# Altium schematic sheet 3rd_eyes.SchDoc
size A3; SheetNumber: 1; SheetTotal: 1
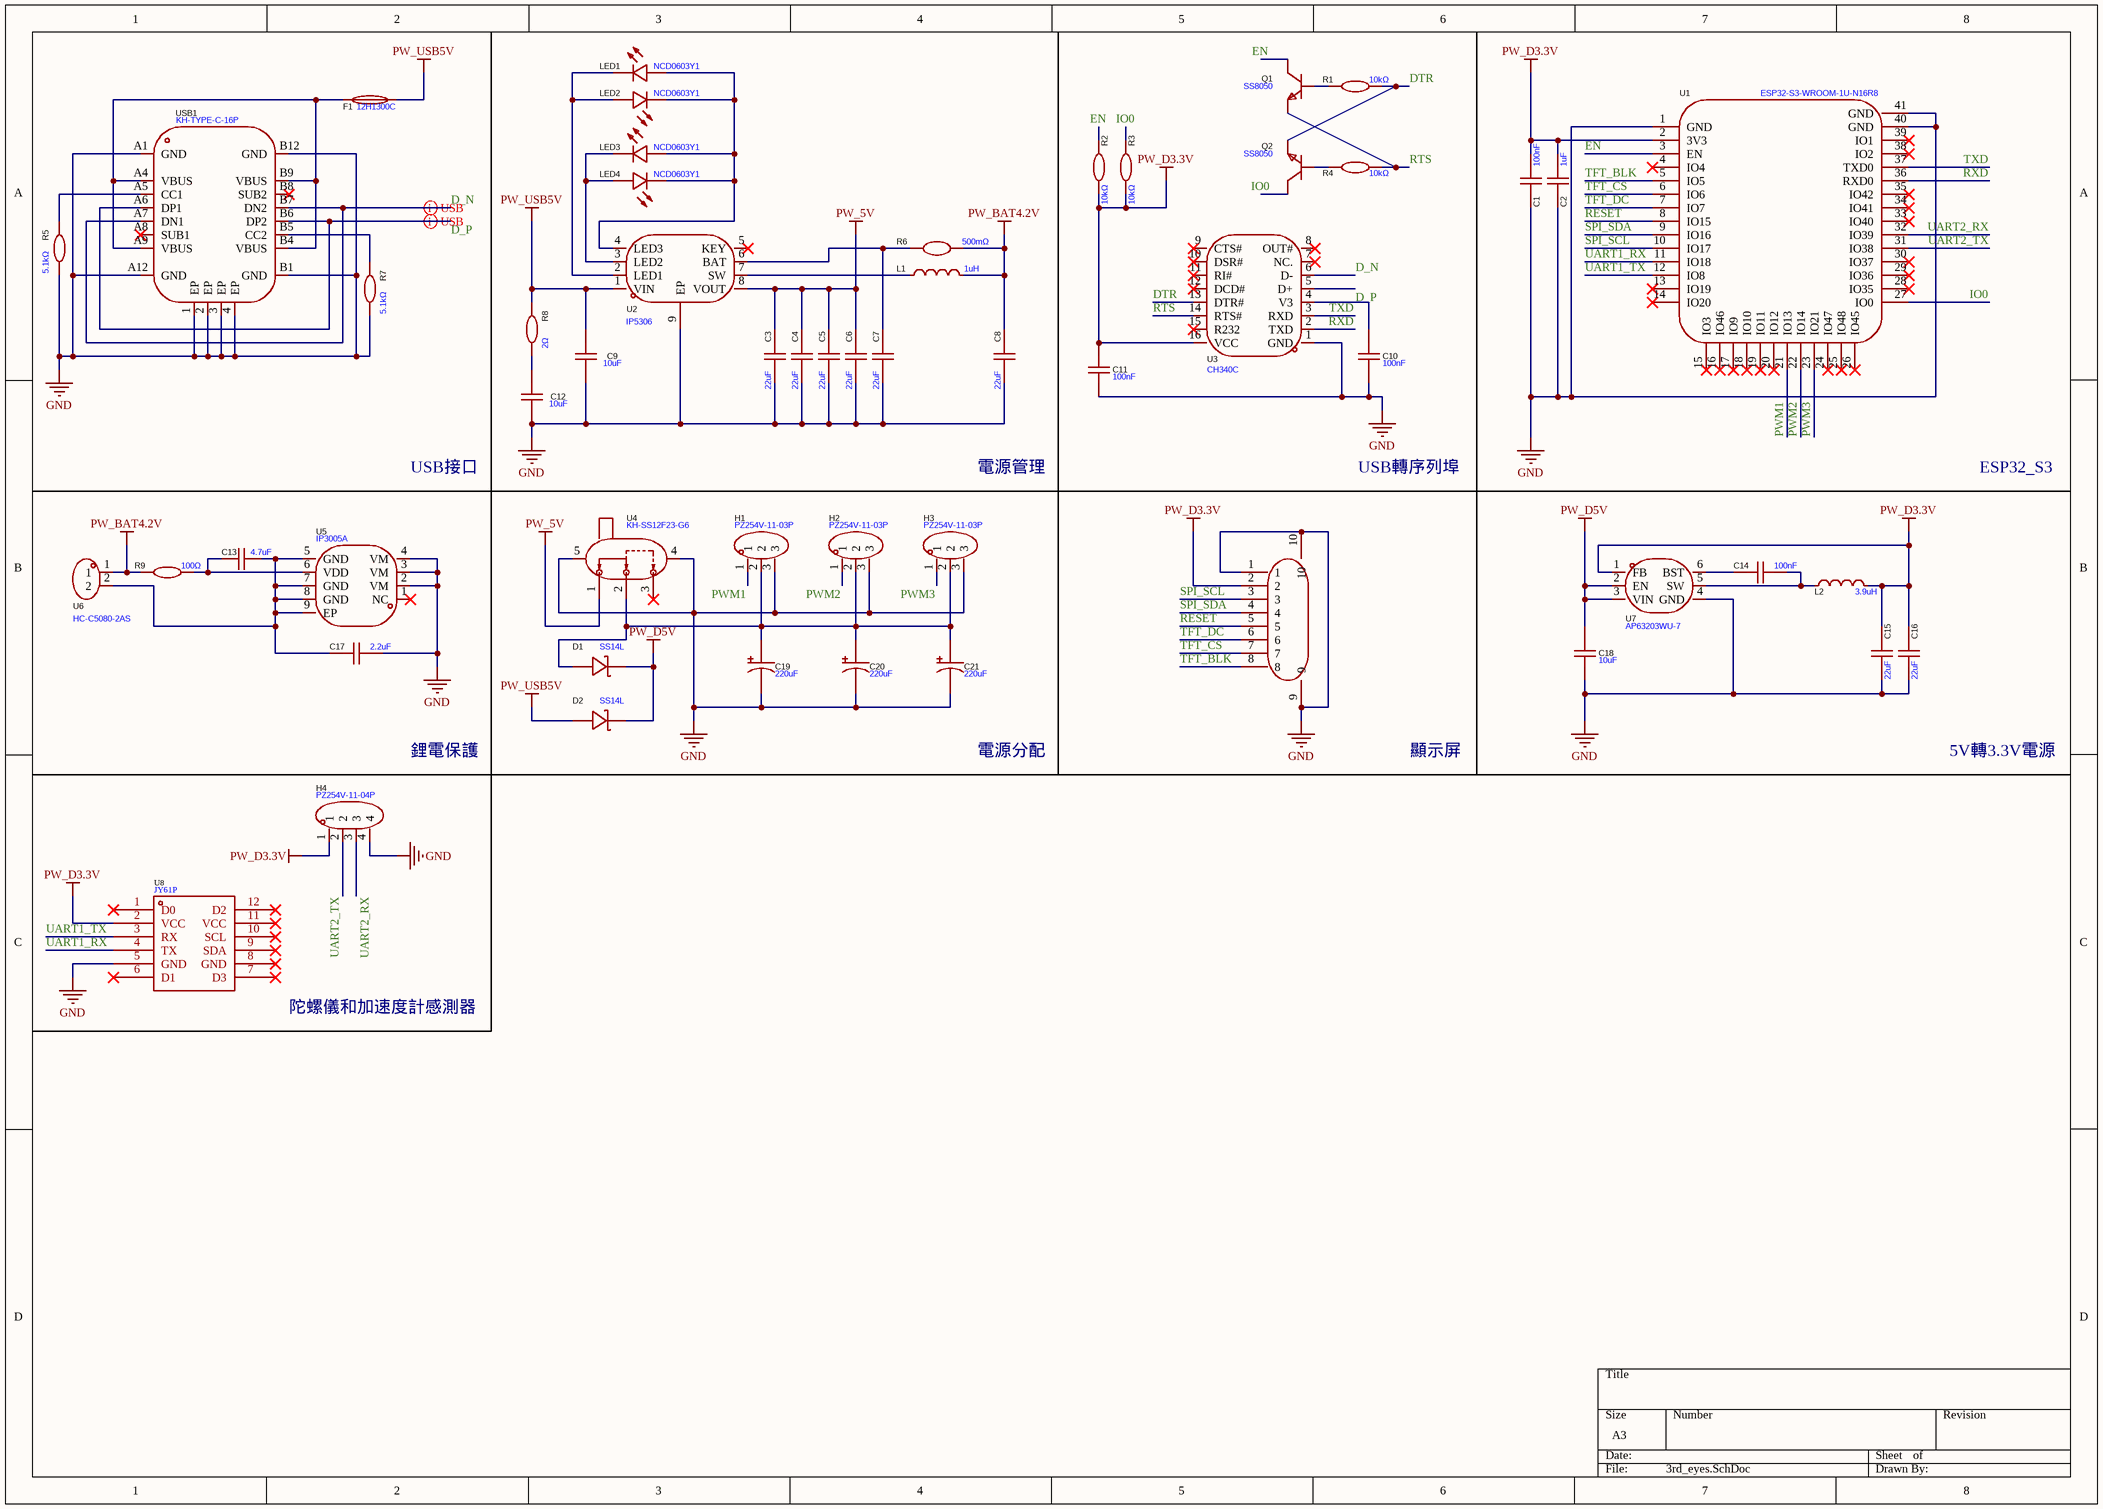
[diagram p0: 3rd_eyes.SchDoc]

## Parts
C1  100nF  [C0603]
C2  1uF  [C0603]
C3  22uF  [C0805]
C4  22uF  [C0805]
C5  22uF  [C0805]
C6  22uF  [C0805]
C7  22uF  [C0805]
C8  22uF  [C0805]
C9  10uF  [C0603]
C10  100nF  [C0603]
C11  100nF  [C0603]
C12  10uF  [C0603]
C13  4.7uF  [C0603]
C14  100nF  [C0603]
C15  22uF  [C0805]
C16  22uF  [C0805]
C17  2.2uF  [C0603]
C18  10uF  [C0603]
C19  220uF  [CAP-SMD_BD6.3-L6.6-W6.6-FD-A]
C20  220uF  [CAP-SMD_BD6.3-L6.6-W6.6-FD-A]
C21  220uF  [CAP-SMD_BD6.3-L6.6-W6.6-FD-A]
D1  SS14L  [SOD-123F_L2.8-W1.8-LS3.7-RD]
D2  SS14L  [SOD-123F_L2.8-W1.8-LS3.7-RD]
F1  12H1300C  [F1206]
FPC1  AFC01-S08FCA-00  [FPC-SMD_P0.50-8P_FGS-XJ-H2.0]  (value not drawn)
H1  PZ254V-11-03P  [HDR-TH_3P-P2.54-V-M]
H2  PZ254V-11-03P  [HDR-TH_3P-P2.54-V-M]
H3  PZ254V-11-03P  [HDR-TH_3P-P2.54-V-M]
H4  PZ254V-11-04P  [HDR-TH_4P-P2.54-V-M]
L1  1uH  [IND-SMD_L7.0-W6.6]
L2  3.9uH  [IND-SMD_L4.0-W4.0_FNR40XXS]
LED1  NCD0603Y1  [LED0603-RD]
LED2  NCD0603Y1  [LED0603-RD]
LED3  NCD0603Y1  [LED0603-RD]
LED4  NCD0603Y1  [LED0603-RD]
Q1  SS8050  [SOT-23-3_L2.9-W1.3-P1.90-LS2.4-BR]
Q2  SS8050  [SOT-23-3_L2.9-W1.3-P1.90-LS2.4-BR]
R1  10kΩ  [R0603]
R2  10kΩ  [R0603]
R3  10kΩ  [R0603]
R4  10kΩ  [R0603]
R5  5.1kΩ  [R0603]
R6  500mΩ  [R0805]
R7  5.1kΩ  [R0603]
R8  2Ω  [R0603]
R9  100Ω  [R0603]
U1  ESP32-S3-WROOM-1U-N16R8  [WIRELM-SMD_ESP32-S3-WROOM-1U]
U2  IP5306  [ESOP-8_L4.9-W3.9-P1.27-LS6.0-BL-EP]
U3  CH340C  [SOP-16_L10.0-W3.9-P1.27-LS6.0-BL]
U4  KH-SS12F23-G6  [SW-TH_KH-SS12F23-G6]
U5  IP3005A  [ESOP-8_L4.9-W3.9-P1.27-LS6.0-BL-EP]
U6  HC-C5080-2AS  [CONN-TH_HC-C5080-2AS]
U7  AP63203WU-7  [TSOT-26_L2.9-W1.6-P0.95-LS2.8-BL]
U8  JY61P  [JY61P]
USB1  KH-TYPE-C-16P  [USB-C-SMD_KH-TYPE-C-16P]

## Nets
GND: C1.1 C2.1 C3.1 C4.1 C5.1 C6.1 C7.1 C8.1 C9.1 C10.1 C11.1 C12.1 C15.2 C16.2 C17.2 C18.1 C19.2 C20.2 C21.2 FPC1.1 FPC1.9 FPC1.10 H1.3 H2.3 H3.3 H4.4 R5.2 R7.2 U1.1(GND) U1.40(GND) U1.41(GND) U2.9(EP) U3.1(GND) U4.4 U4.5 U5.2(VM) U5.3(VM) U5.4(VM) U7.4(GND) U8.5(GND) USB1.1(EP) USB1.2(EP) USB1.3(EP) USB1.4(EP) USB1.A1(GND) USB1.A12(GND) USB1.B1(GND) USB1.B12(GND)
PW_5V: C3.2 C4.2 C5.2 C6.2 U2.8(VOUT) U4.1
PW_BAT4.2V: C8.2 L1.2 R6.2 R9.1 U6.1
PW_D3.3V: C1.2 C2.2 C11.2 C15.1 C16.1 FPC1.2 H4.1 L2.2 R2.2 R3.2 U1.2(3V3) U3.16(VCC) U7.1(FB) U8.2(VCC)
PW_D5V: C18.2 D1.1(K) D2.1(K) U7.2(EN) U7.3(VIN)
PW_USB5V: C9.2 D2.2(A) F1.2 R8.1 U2.1(VIN)
D_N: U3.6(D-) USB1.A7(DN1) USB1.B7(DN2)
D_P: U3.5(D+) USB1.A6(DP1) USB1.B6(DP2)
DTR: Q2.2(E) R1.2 U3.13(DTR#)
EN: Q1.3(C) R2.1 U1.3(EN)
IO0: Q2.3(C) R3.1 U1.27(IO0)
PWM1: H1.1 U1.21(IO13)
PWM2: H2.1 U1.22(IO14)
PWM3: H3.1 U1.23(IO21)
RESET: FPC1.5 U1.8(IO15)
RTS: Q1.2(E) R4.2 U3.14(RTS#)
RXD: U1.36(RXD0) U3.2(TXD)
SPI_SCL: FPC1.3 U1.10(IO17)
SPI_SDA: FPC1.4 U1.9(IO16)
TFT_BLK: FPC1.8 U1.5(IO5)
TFT_CS: FPC1.7 U1.6(IO6)
TFT_DC: FPC1.6 U1.7(IO7)
TXD: U1.37(TXD0) U3.3(RXD)
UART1_RX: U1.11(IO18) U8.4(TX)
UART1_TX: U1.12(IO8) U8.3(RX)
UART2_RX: H4.3 U1.32(IO39)
UART2_TX: H4.2 U1.31(IO38)
NetC7_2: C7.2 R6.1 U2.6(BAT)
NetC10_2: C10.2 U3.4(V3)
NetC12_2: C12.2 R8.2
NetC13_1: C13.1 R9.2 U5.6(VDD)
NetC13_2: C13.2 C17.1 U5.5(GND) U5.7(GND) U5.8(GND) U5.9(EP) U6.2
NetC14_1: C14.1 U7.6(BST)
NetC14_2: C14.2 L2.1 U7.5(SW)
NetC19_1: C19.1 C20.1 C21.1 D1.2(A) H1.2 H2.2 H3.2 U4.2
NetF1_1: F1.1 USB1.A4(VBUS) USB1.A9(VBUS) USB1.B4(VBUS) USB1.B9(VBUS)
NetL1_1: L1.1 U2.7(SW)
NetLED1_1: LED1.1(K) LED2.2(A) U2.2(LED1)
NetLED1_2: LED1.2(A) LED2.1(K) LED3.2(A) LED4.1(K) U2.4(LED3)
NetLED3_1: LED3.1(K) LED4.2(A) U2.3(LED2)
NetQ1_1: Q1.1(B) R1.1
NetQ2_1: Q2.1(B) R4.1
NetR5_1: R5.1 USB1.A5(CC1)
NetR7_1: R7.1 USB1.B5(CC2)

Not connected (* = marked no-connect by the designer): U1 4(IO4)* 13(IO19)* 14(IO20)* 15(IO3)* 16(IO46)* 17(IO9)* 18(IO10)* 19(IO11)* 20(IO12)* 24(IO47)* 25(IO48)* 26(IO45)* 28(IO35)* 29(IO36)* 30(IO37)* 33(IO40)* 34(IO41)* 35(IO42)* 38(IO2)* 39(IO1)*; U2 5(KEY)*; U3 7(NC.)* 8(OUT#)* 9(CTS#)* 10(DSR#)* 11(RI#)* 12(DCD#)* 15(R232)*; U4 3*; U5 1(NC)*; U8 1(D0)* 6(D1)* 7(D3)* 8(GND)* 9(SDA)* 10(SCL)* 11(VCC)* 12(D2)*; USB1 A8(SUB1)* B8(SUB2)*

## Layout directives
differential pair: D_N, D_P

## Notes on the sheet
- USB接口
- 電源管理
- USB轉序列埠
- ESP32_S3
- 鋰電保護
- 電源分配
- 顯示屏
- 5V轉3.3V電源
- 陀螺儀和加速度計感測器

## Library data of the parts
C1 C10 C11 C14 = CL10B104KB8NNNC: Manufacturer: SAMSUNG(三星); Add into BOM: yes; Tolerance: ±10%; Voltage Rated: 50V; Temperature Coefficient: X7R; Symbol: CL10B104KB8NNNC; Device: CL10B104KB8NNNC; LCSC Part Name: 100nF ±10% 50V; Supplier Part: C1591; Manufacturer Part: CL10B104KB8NNNC; Supplier Footprint: 0603; JLCPCB Part Class: Extended Part; Datasheet: https://atta.szlcsc.com/upload/public/pdf/source/20160218/1457707763339.pdf; Supplier: LCSC; Convert to PCB: yes; Value: 100nF
C2 = CL10A105KB8NNNC: Manufacturer: SAMSUNG(三星); Add into BOM: yes; Tolerance: ±10%; Voltage Rated: 50V; Temperature Coefficient: X5R; Symbol: CL10A105KB8NNNC; Device: CL10A105KB8NNNC; LCSC Part Name: 1uF ±10% 50V; Supplier Part: C15849; Manufacturer Part: CL10A105KB8NNNC; Supplier Footprint: 0603; JLCPCB Part Class: Basic Part; Datasheet: https://atta.szlcsc.com/upload/public/pdf/source/20160218/1457707763339.pdf; Supplier: LCSC; Convert to PCB: yes; Value: 1uF
C3-C8 C15 C16 = CL21A226MAQNNNE: Manufacturer: SAMSUNG(三星); Add into BOM: yes; Tolerance: ±20%; Voltage Rated: 25V; Temperature Coefficient: X5R; Symbol: CL21A226MAQNNNE; Device: CL21A226MAQNNNE; LCSC Part Name: 22uF ±20% 25V; Supplier Part: C45783; Manufacturer Part: CL21A226MAQNNNE; Supplier Footprint: 0805; JLCPCB Part Class: Basic Part; Datasheet: https://atta.szlcsc.com/upload/public/pdf/source/20160218/1457707763339.pdf; Supplier: LCSC; Convert to PCB: yes; Value: 22uF
C9 C12 C18 = CL10A106MA8NRNC: Manufacturer: SAMSUNG(三星); Add into BOM: yes; Tolerance: ±20%; Voltage Rated: 25V; Temperature Coefficient: X5R; Symbol: CL10A106MA8NRNC; Device: CL10A106MA8NRNC; LCSC Part Name: 10uF ±20% 25V; Supplier Part: C96446; Manufacturer Part: CL10A106MA8NRNC; Supplier Footprint: 0603; JLCPCB Part Class: Basic Part; Datasheet: https://atta.szlcsc.com/upload/public/pdf/source/20160218/1457707763339.pdf; Supplier: LCSC; Convert to PCB: yes; Value: 10uF
C13 = CL10A475KO8NNNC: Manufacturer: SAMSUNG(三星); Add into BOM: yes; Tolerance: ±10%; Voltage Rated: 16V; Temperature Coefficient: X5R; Symbol: CL10A475KO8NNNC; Device: CL10A475KO8NNNC; LCSC Part Name: 4.7uF ±10% 16V; Supplier Part: C19666; Manufacturer Part: CL10A475KO8NNNC; Supplier Footprint: 0603; JLCPCB Part Class: Basic Part; Datasheet: https://atta.szlcsc.com/upload/public/pdf/source/20160218/1457707763339.pdf; Supplier: LCSC; Convert to PCB: yes; Value: 4.7uF
C17 = CL10A225KB8NNNC: Manufacturer: SAMSUNG(三星); Add into BOM: yes; Tolerance: ±10%; Voltage Rated: 50V; Temperature Coefficient: X5R; Symbol: CL10A225KB8NNNC; Device: CL10A225KB8NNNC; LCSC Part Name: 2.2uF ±10% 50V; Supplier Part: C913904; Manufacturer Part: CL10A225KB8NNNC; Supplier Footprint: 0603; JLCPCB Part Class: Extended Part; Datasheet: https://atta.szlcsc.com/upload/public/pdf/source/20160218/1457707763339.pdf; Supplier: LCSC; Convert to PCB: yes; Value: 2.2uF
C19-C21 = OVZ221M0JTR-0606: Manufacturer: lelon(立隆); Add into BOM: yes; Tolerance: ±20%; Voltage Rated: 6.3V; Ripple Current: 3.16A@100kHz; Lifetime @ Temp: 2000hrs@105℃; Symbol: OVZ221M0JTR-0606; Device: OVZ221M0JTR-0606; LCSC Part Name: 220uF ±20% 6.3V; Supplier Part: C182403; Manufacturer Part: OVZ221M0JTR-0606; Supplier Footprint: SMD,D6.3xL5.9mm; JLCPCB Part Class: Extended Part; Datasheet: https://atta.szlcsc.com/upload/public/pdf/source/20180224/C182403_15194369721561364002.pdf; Supplier: LCSC; Convert to PCB: yes; Value: 220uF; Equivalent Series Resistance(ESR): -; Type: -; Lead Spacing: -; Diameter: 6.3mm; Height - Seated (Max): 5.9mm; Operating Temperature: -55℃~+105℃
D1 D2 = SS14L: Manufacturer: Hottech(合科泰); Symbol: SS14L_C190475; Add into BOM: yes; Forward Voltage (Vf@If): 550mV@1A; Reverse Voltage (Vr): 40V; Rectified Current: 1A; Device: SS14L; LCSC Part Name: 电压:40V 电流:1A; Supplier Part: C190475; Manufacturer Part: SS14L; Supplier Footprint: SOD-123FL; JLCPCB Part Class: Extended Part; Datasheet: https://atta.szlcsc.com/upload/public/pdf/source/20220428/72E7AB72DDDD17C14C2A3F6F251D8FA3.pdf; Supplier: LCSC; Convert to PCB: yes
F1 = 12H1300C: Manufacturer: LANSON(良胜); Add into BOM: yes; Type: 贴片式保险丝; Current Rating: 3A; Voltage Rating (DC): 63V; Breaking Capacity: 50A; Symbol: 12H1300C; Device: 12H1300C; LCSC Part Name: 贴片式保险丝; Supplier Part: C182445; Manufacturer Part: 12H1300C; Supplier Footprint: 1206; JLCPCB Part Class: Extended Part; Datasheet: https://atta.szlcsc.com/upload/public/pdf/source/20180301/C182975_15198945731771384144.pdf; Supplier: LCSC; Convert to PCB: yes; Operating Temperature: -55℃~+125℃
FPC1 = AFC01-S08FCA-00: Manufacturer: JS(钜硕电子); Add into BOM: yes; Locking Feature: 翻盖式; Number of Contacts: 8P; Pitch: 0.5mm; FFC, FCB Thickness: 0.3mm; Symbol: AFC01-S08FCA-00; Device: AFC01-S08FCA-00; LCSC Part Name: 间距:0.5mm P数:8P 翻盖式 下接; Supplier Part: C262657; Manufacturer Part: AFC01-S08FCA-00; Supplier Footprint: SMD,P=0.5mm,卧贴; JLCPCB Part Class: Extended Part; Datasheet: https://atta.szlcsc.com/upload/public/pdf/source/20190816/C413942_2A72D1AC756EAE17EEDF756A339D4500.pdf; Supplier: LCSC; Convert to PCB: yes; Contact Type: 下接; Mounting Type: 卧贴; Height Above Board: 2mm
H1-H3 = PZ254V-11-03P: Manufacturer: XFCN(兴飞); Symbol: PZ254V-11-03P_C2937625; Add into BOM: yes; Pin Structure: 1x3P; Pitch: 2.54mm; Circluar Pins/Square Pins: 方针; Current Rating (Max): 3A; Voltage Rating (Max): 250V; Device: PZ254V-11-03P; LCSC Part Name: 间距:2.54mm 1x3P 直插 方针; Supplier Part: C2937625; Manufacturer Part: PZ254V-11-03P; Supplier Footprint: 插件,P=2.54mm; JLCPCB Part Class: Extended Part; Datasheet: https://atta.szlcsc.com/upload/public/pdf/source/20200309/C492402_8335C3D49C4E4C618838D59BB1D024C1.pdf; Supplier: LCSC; Convert to PCB: yes; Row Spacing: -; Mounting Type: 直插; Number of Rows: 单排; Number of Pins: 3P; Length of Mating Pin: 6mm; Insulation Height: 2.5mm; Length of End Connection Pin: 3mm; Operating Temperature Range: -40℃~+105℃; Color: 黑色
H4 = PZ254V-11-04P_C492403: Manufacturer: XFCN(兴飞); Add into BOM: yes; Pin Structure: 1x4P; Pitch: 2.54mm; Circluar Pins/Square Pins: 方针; Symbol: PZ254V-11-04P; Device: PZ254V-11-04P_C492403; LCSC Part Name: 间距:2.54mm 1x4P 直插 方针; Supplier Part: C492403; Manufacturer Part: PZ254V-11-04P; Supplier Footprint: 插件,P=2.54mm; JLCPCB Part Class: Extended Part; Datasheet: https://atta.szlcsc.com/upload/public/pdf/source/20200309/C492403_F9F19131791D08044AD4F84F8E751A34.pdf; Supplier: LCSC; Convert to PCB: yes; Row Spacing: -; Mounting Type: 直插; Number of Rows: 单排; Number of Pins: 4P; Current Rating (Max): -; Voltage Rating (Max): -; Length of Mating Pin: 6mm; Insulation Height: 2.5mm; Length of End Connection Pin: 3mm; Contact Material: 黄铜; Contact Plating: -; Operating Temperature Range: -40℃~+105℃; Color: 黑色
L1 = FXL0630-1R0-M: Manufacturer: cjiang(长江微电); Add into BOM: yes; Tolerance: ±20%; Rated Current: 12A; Saturation Current (Isat): 15A; DC Resistance (DCR): 7.4mΩ; Type: 一体成型电感; Symbol: FXL0630-1R0-M; Device: FXL0630-1R0-M; LCSC Part Name: 1uH ±20% 15A; Supplier Part: C167216; Manufacturer Part: FXL0630-1R0-M; Supplier Footprint: SMD,6.6x7mm; JLCPCB Part Class: Extended Part; Datasheet: https://atta.szlcsc.com/upload/public/pdf/source/20240426/3189EA8206330E2108542F9E34E540E7.pdf; Supplier: LCSC; Convert to PCB: yes; Value: 1uH
L2 = FNR4030S3R9MT: Manufacturer: cjiang(长江微电); Add into BOM: yes; Tolerance: ±20%; Rated Current: 2.3A; Saturation Current (Isat): 3.3A; DC Resistance (DCR): 74mΩ; Symbol: FNR4030S3R9MT; Device: FNR4030S3R9MT; LCSC Part Name: 3.9uH ±20% 3.3A; Supplier Part: C167872; Manufacturer Part: FNR4030S3R9MT; Supplier Footprint: SMD,4x4mm; JLCPCB Part Class: Extended Part; Datasheet: https://atta.szlcsc.com/upload/public/pdf/source/20190327/C167925_9EFF0AABC4CA629C2CC95961DBF7D39D.pdf; Supplier: LCSC; Convert to PCB: yes; Value: 3.9uH
LED1-LED4 = NCD0603Y1: Manufacturer: 国星光电; Symbol: FC-D1608HYK-588J; Add into BOM: yes; Emitted Color: 黄色; Forward Voltage (VF): 1.6V~2.6V; Power Dissipation: 65mW; Forward Current: 20mA; Dominant Wavelength: 586nm~595nm; Lens Color: 无色透明透镜; Luminous Intensity: 80mcd~220mcd; Viewing Angle: 130°; Device: NCD0603Y1; LCSC Part Name: NCD0603Y1; Supplier Part: C84268; Manufacturer Part: NCD0603Y1; Supplier Footprint: 0603; JLCPCB Part Class: Extended Part; Datasheet: https://atta.szlcsc.com/upload/public/pdf/source/20200820/C84268_8FC106CB292CF978F9CFC6892464F83C.pdf; Supplier: LCSC; Convert to PCB: yes; Operating Temperature: -30℃~+85℃
Q1 Q2 = SS8050_C541705: Manufacturer: AnBon(安邦); Add into BOM: yes; Transistor Type: NPN; Collector Current (Ic): 1.5A; Collector-Emitter Breakdown Voltage (Vceo): 25V; Power Dissipation (Pd): 225mW; DC Current Gain (hFE@Ic,Vce): 200@100mA,1V; Collector Cut-Off Current (Icbo): 150nA; Collector-Emitter Saturation Voltage (VCE(sat)@Ic,Ib): 500mV@800mA,80mA; Symbol: SS8050_C541705; Device: SS8050_C541705; LCSC Part Name: 耐压:25V 电流:1.5A NPN; Supplier Part: C541705; Manufacturer Part: SS8050; Supplier Footprint: SOT-23; JLCPCB Part Class: Extended Part; Datasheet: https://atta.szlcsc.com/upload/public/pdf/source/20200522/C541705_DD3461D9C64B1D59801CB3041082AFC6.pdf; Supplier: LCSC; Convert to PCB: yes; Transition Frequency (fT): -; Operating Temperature: -55℃~+150℃@(Tj)
R1-R4 = 0603WAF1002T5E: Manufacturer: UNI-ROYAL(厚声); Add into BOM: yes; Tolerance: ±1%; Power(Watts): 100mW; Overload Voltage (Max): 75V; Temperature Coefficient: ±100ppm/℃; Symbol: 0603WAF1002T5E; Device: 0603WAF1002T5E; LCSC Part Name: 厚膜电阻 10kΩ ±1% 100mW; Supplier Part: C25804; Manufacturer Part: 0603WAF1002T5E; Supplier Footprint: 0603; JLCPCB Part Class: Basic Part; Datasheet: https://atta.szlcsc.com/upload/public/pdf/source/20200306/C422600_1E6D84923E4A46A82E41ADD87F860B5C.pdf; Supplier: LCSC; Convert to PCB: yes; Type: 厚膜电阻; Value: 10kΩ; Operating Temperature Range: -55℃~+155℃
R5 R7 = 0603WAF5101T5E: Manufacturer: UNI-ROYAL(厚声); Add into BOM: yes; Tolerance: ±1%; Power(Watts): 100mW; Overload Voltage (Max): 75V; Temperature Coefficient: ±100ppm/℃; Symbol: 0603WAF5101T5E; Device: 0603WAF5101T5E; LCSC Part Name: 5.1kΩ ±1% 100mW 厚膜电阻; Supplier Part: C23186; Manufacturer Part: 0603WAF5101T5E; Supplier Footprint: 0603; JLCPCB Part Class: Basic Part; Datasheet: https://atta.szlcsc.com/upload/public/pdf/source/20200306/C422600_1E6D84923E4A46A82E41ADD87F860B5C.pdf; Supplier: LCSC; Convert to PCB: yes; Type: 厚膜电阻; Value: 5.1kΩ; Operating Temperature Range: -55℃~+155℃
R6 = FRL0805JR500TS: Manufacturer: FOJAN(富捷); Add into BOM: yes; Tolerance: ±5%; Power(Watts): 125mW; Overload Voltage (Max): 300V; Temperature Coefficient: ±300ppm/℃; Symbol: FRL0805JR500TS; Device: FRL0805JR500TS; LCSC Part Name: 500mΩ ±5% 125mW 厚膜电阻; Supplier Part: C2934281; Manufacturer Part: FRL0805JR500TS; Supplier Footprint: 0805; JLCPCB Part Class: Extended Part; Datasheet: https://atta.szlcsc.com/upload/public/pdf/source/20211221/925EC7D7225764EE0046F22065062C87.pdf; Supplier: LCSC; Convert to PCB: yes; Type: 厚膜电阻; Value: 500mΩ; Operating Temperature Range: -55℃~+155℃
R8 = 0603WAF200KT5E: Manufacturer: UNI-ROYAL(厚声); Add into BOM: yes; Tolerance: ±1%; Power(Watts): 100mW; Overload Voltage (Max): 75V; Temperature Coefficient: ±200ppm/℃; Symbol: 0603WAF200KT5E; Device: 0603WAF200KT5E; LCSC Part Name: 2Ω ±1% 100mW 厚膜电阻; Supplier Part: C22977; Manufacturer Part: 0603WAF200KT5E; Supplier Footprint: 0603; JLCPCB Part Class: Basic Part; Datasheet: https://atta.szlcsc.com/upload/public/pdf/source/20200306/C422600_1E6D84923E4A46A82E41ADD87F860B5C.pdf; Supplier: LCSC; Convert to PCB: yes; Type: 厚膜电阻; Value: 2Ω; Operating Temperature Range: -55℃~+155℃
R9 = 0603WAF1000T5E: Manufacturer: UNI-ROYAL(厚声); Add into BOM: yes; Tolerance: ±1%; Power(Watts): 100mW; Overload Voltage (Max): 75V; Temperature Coefficient: ±200ppm/℃; Symbol: 0603WAF1000T5E; Device: 0603WAF1000T5E; LCSC Part Name: 100Ω ±1% 100mW 厚膜电阻; Supplier Part: C22775; Manufacturer Part: 0603WAF1000T5E; Supplier Footprint: 0603; JLCPCB Part Class: Basic Part; Datasheet: https://atta.szlcsc.com/upload/public/pdf/source/20200306/C422600_1E6D84923E4A46A82E41ADD87F860B5C.pdf; Supplier: LCSC; Convert to PCB: yes; Type: 厚膜电阻; Value: 100Ω; Operating Temperature Range: -55℃~+155℃
U1 = ESP32-S3-WROOM-1U-N16R8: Manufacturer: ESPRESSIF(乐鑫); Add into BOM: yes; Symbol: ESP32-S3-WROOM-1U-N16R8; Device: ESP32-S3-WROOM-1U-N16R8; LCSC Part Name: ESP32-S3-WROOM-1U-N16R8; Supplier Part: C3013946; Manufacturer Part: ESP32-S3-WROOM-1U-N16R8; Supplier Footprint: SMD,18x19.2mm; JLCPCB Part Class: Extended Part; Datasheet: https://atta.szlcsc.com/upload/public/pdf/source/20240130/9D71F4DF55874C504AB629FEEE3F038E.pdf; Supplier: LCSC; Convert to PCB: yes
U2 = IP5306: Manufacturer: INJOINIC(英集芯); Add into BOM: yes; Symbol: IP5306; Device: IP5306; LCSC Part Name: IP5306; Supplier Part: C181692; Manufacturer Part: IP5306; Supplier Footprint: ESOP-8; JLCPCB Part Class: Extended Part; Datasheet: https://atta.szlcsc.com/upload/public/pdf/source/20190627/C384572_9925B3DDC4041BC6108E5AB46A2A0AB1.pdf; Supplier: LCSC; Convert to PCB: yes
U3 = CH340C: Manufacturer: WCH(南京沁恒); Add into BOM: yes; Applications Function: 收发器; Protocol: USB 2.0; Supply Voltage: 3.3V；5V; Data Rate: 2Mbps; Symbol: CH340C; Device: CH340C; LCSC Part Name: CH340C USB转串口芯片 CH340; Supplier Part: C84681; Manufacturer Part: CH340C; Supplier Footprint: SOP-16; JLCPCB Part Class: Extended Part; Datasheet: https://atta.szlcsc.com/upload/public/pdf/source/20240619/63986D8440D4E5267A77ACD891CC4DE3.pdf; Supplier: LCSC; Convert to PCB: yes
U4 = KH-SS12F23-G6: Manufacturer: kinghelm(金航标); Add into BOM: yes; Symbol: KH-SS12F23-G6; Device: KH-SS12F23-G6; LCSC Part Name: 拨动开关 KH-SS12F23-G6; Supplier Part: C5274466; Manufacturer Part: KH-SS12F23-G6; Supplier Footprint: 插件; JLCPCB Part Class: Extended Part; Datasheet: https://atta.szlcsc.com/upload/public/pdf/source/20221118/BFF37B84B5CB1A55659AB56BFB65BEAA.pdf; Supplier: LCSC; Convert to PCB: yes
U5 = IP3005A: Manufacturer: INJOINIC(英集芯); Add into BOM: yes; Symbol: IP3005A; Device: IP3005A; LCSC Part Name: IP3005A; Supplier Part: C181685; Manufacturer Part: IP3005A; Supplier Footprint: ESOP-8; JLCPCB Part Class: Extended Part; Datasheet: https://atta.szlcsc.com/upload/public/pdf/source/20181019/C181685_8FCD62B90ABBC24A3EFF28CA6DF89AAB.pdf; Supplier: LCSC; Convert to PCB: yes
U6 = HC-C5080-2AS: Manufacturer: HCTL(华灿天禄); Add into BOM: yes; Pins Structure: 1x2P; Pitch: 5.08mm; Reference Series: 大4pin; Number of PINs Per Row: 2; Current Rating (Max): 10A; Rated Voltage (Max): 250V; Plastic Material: PA66; Flame Retardant Rating: UL94V-0; Z-Height of the Board: 10.5mm; X-Length of Bottom Edge on Board (Spacing Line): 13.84mm; Y-Width of Bottom Edge on Board: 8.5mm; Symbol: HC-C5080-2AS; Device: HC-C5080-2AS; LCSC Part Name: 1x2P 间距:5.08mm 直插 系列:大4pin; Supplier Part: C5221225; Manufacturer Part: HC-C5080-2AS; Supplier Footprint: 插件,P=5.08mm; JLCPCB Part Class: Extended Part; Datasheet: https://atta.szlcsc.com/upload/public/pdf/source/20241030/F3FABA2A64EED564336AF49B22573160.pdf; Supplier: LCSC; Convert to PCB: yes; Mounting Style: 直插; Number of Pins: 2P; Number of Rows: 1; Row Spacing: -; Contact Material: 黄铜; Contact Plating: 锡; Operating Temperature Range: -25℃~+85℃; Supplementary Features: -; Colour: -
U7 = AP63203WU-7: Manufacturer: DIODES(美台); Add into BOM: yes; Function: 降压型; Output Type: 固定; Input Voltage: 3.8V~32V; Output Voltage: 3.3V; Output Current: 2A; Switching Frequency: 1.1MHz; Synchronous Rectification: 是; Number of Outputs: 1; Topology: 降压式; Quiescent Current (Iq): 22uA; Switch tube (built-in/external): 内置; Symbol: AP63203WU-7; Device: AP63203WU-7; LCSC Part Name: 3.8V至32V输入、2A低静态电流同步降压转换器，增强EMI抑制; Supplier Part: C780769; Manufacturer Part: AP63203WU-7; Supplier Footprint: TSOT-23-6; JLCPCB Part Class: Extended Part; Datasheet: https://atta.szlcsc.com/upload/public/pdf/source/20210622/C780769_099C67289BD3EC61AAFB52D8B07125B3.pdf; Supplier: LCSC; Convert to PCB: yes; Operating Temperature: -40℃~+85℃@(TA)
USB1 = KH-TYPE-C-16P: Manufacturer: kinghelm(金航标); Add into BOM: yes; Connector Type: Type-C; Gender: 母; Number of Ports: 1; Number of Contacts: 16P; Current Rating - Power (Max): 3A; Symbol: KH-TYPE-C-16P; Device: KH-TYPE-C-16P; LCSC Part Name: Type-C 母 卧贴; Supplier Part: C709357; Manufacturer Part: KH-TYPE-C-16P; Supplier Footprint: SMD; JLCPCB Part Class: Extended Part; Datasheet: https://atta.szlcsc.com/upload/public/pdf/source/20200911/C709357_AA8DCEB38BB20E3035A7ED7AE7667837.pdf; Supplier: LCSC; Convert to PCB: yes; Standard: -; Mounting Style: 卧贴; Operating Temperature Range: -40℃~+85℃